# EAGLE design ffboard_adapter (EAGLE 9.6.2)
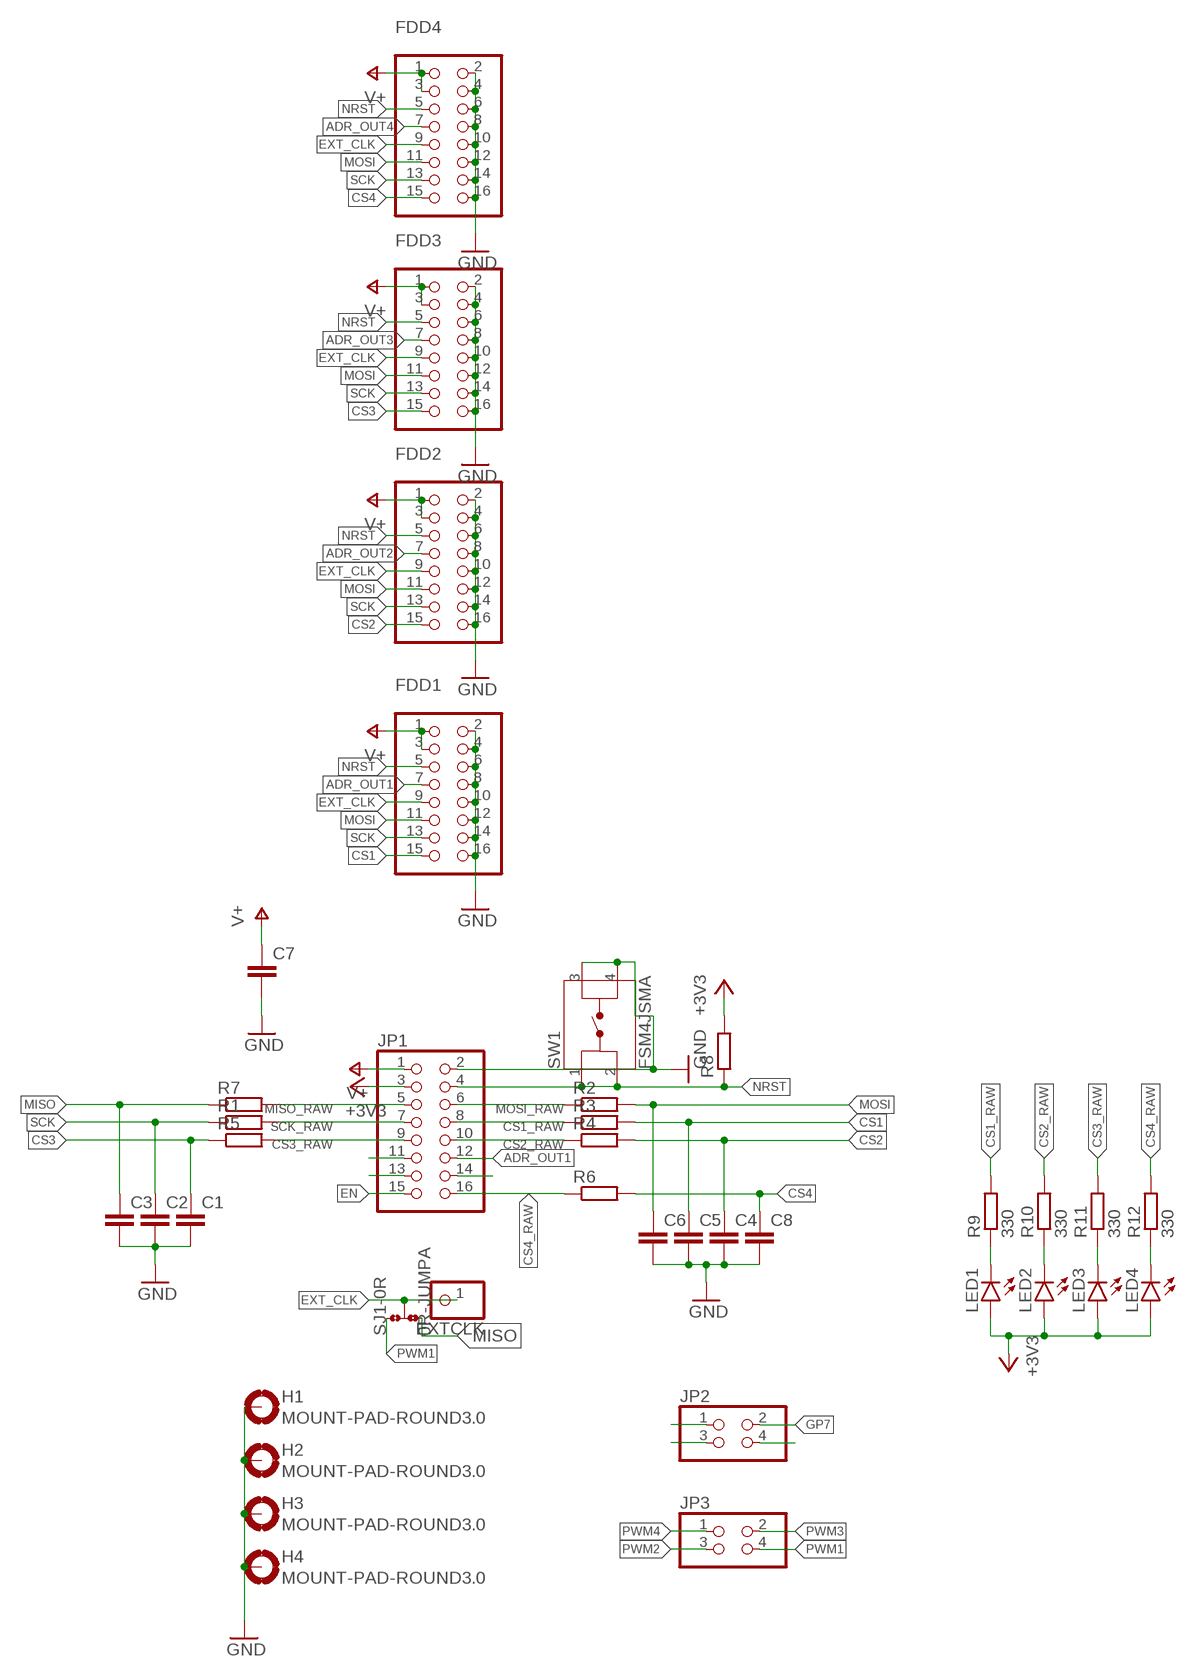
[diagram p0: schematic, sheet 1]

## Parts
C1  C-EUC0603  [C0603]
C2  C-EUC0603  [C0603]
C3  C-EUC0603  [C0603]
C4  C-EUC0603  [C0603]
C5  C-EUC0603  [C0603]
C6  C-EUC0603  [C0603]
C7  C-EUC0603  [C0603]
C8  C-EUC0603  [C0603]
EXTCLK  PINHD-1X1  [1X01]
FDD1  C221085  PINHD-2X8  [2X08]
FDD2  C221085  PINHD-2X8  [2X08]
FDD3  C221085  PINHD-2X8  [2X08]
FDD4  C221085  PINHD-2X8  [2X08]
H1  MOUNT-PAD-ROUND3.0  [3,0-PAD]
H2  MOUNT-PAD-ROUND3.0  [3,0-PAD]
H3  MOUNT-PAD-ROUND3.0  [3,0-PAD]
H4  MOUNT-PAD-ROUND3.0  [3,0-PAD]
JP1  PINHD-2X8  [2X08]
JP2  PINHD-2X2  [2X02]
JP3  PINHD-2X2  [2X02]
LED1  LEDSML0805  [SML0805]
LED2  LEDSML0805  [SML0805]
LED3  LEDSML0805  [SML0805]
LED4  LEDSML0805  [SML0805]
R1  R-EU_R0603  [R0603]
R2  R-EU_R0603  [R0603]
R3  R-EU_R0603  [R0603]
R4  R-EU_R0603  [R0603]
R5  R-EU_R0603  [R0603]
R6  R-EU_R0603  [R0603]
R7  R-EU_R0603  [R0603]
R8  R-EU_R0603  [R0603]
R9  330  R-EU_R0603  [R0603]
R10  330  R-EU_R0603  [R0603]
R11  330  R-EU_R0603  [R0603]
R12  330  R-EU_R0603  [R0603]
SJ1  0R-JUMPA  [A0R-JMP]
SW1  FSM4JSMA  [FSM4JSMA]

## Nets
+3V3: JP1.3 LED1.A LED2.A LED3.A LED4.A R8.2
ADR_OUT1: FDD1.7 JP1.12
ADR_OUT2: FDD2.7
ADR_OUT3: FDD3.7
ADR_OUT4: FDD4.7
CS1: C5.1 FDD1.15 R3.2
CS1_RAW: JP1.8 R3.1 R9.2
CS2: C4.1 FDD2.15 R4.2
CS2_RAW: JP1.10 R4.1 R10.2
CS3: C1.1 FDD3.15 R5.1
CS3_RAW: JP1.9 R5.2 R11.2
CS4: C8.1 FDD4.15 R6.2
CS4_RAW: JP1.16 R6.1 R12.2
EN: JP1.15
EXT_CLK: EXTCLK.1 FDD1.9 FDD2.9 FDD3.9 FDD4.9 SJ1.2
GND: C1.2 C2.2 C3.2 C4.2 C5.2 C6.2 C7.2 C8.2 FDD1.2 FDD1.4 FDD1.6 FDD1.8 FDD1.10 FDD1.12 FDD1.14 FDD1.16 FDD2.2 FDD2.4 FDD2.6 FDD2.8 FDD2.10 FDD2.12 FDD2.14 FDD2.16 FDD3.2 FDD3.4 FDD3.6 FDD3.8 FDD3.10 FDD3.12 FDD3.14 FDD3.16 FDD4.2 FDD4.4 FDD4.6 FDD4.8 FDD4.10 FDD4.12 FDD4.14 FDD4.16 H1.B3,0(MOUNT) H2.B3,0(MOUNT) H3.B3,0(MOUNT) H4.B3,0(MOUNT) JP1.2 SW1.3 SW1.4
GP7: JP2.2
MISO: C3.1 R7.1 SJ1.3
MISO_RAW: JP1.5 R7.2
MOSI: C6.1 FDD1.11 FDD2.11 FDD3.11 FDD4.11 R2.2
MOSI_RAW: JP1.6 R2.1
N$1: LED1.C R9.1
N$2: LED2.C R10.1
N$3: LED3.C R11.1
N$4: LED4.C R12.1
N$6: JP1.11
N$7: JP1.13
N$10: JP1.14
N$12: JP2.4
N$14: JP2.1
N$15: JP2.3
NRST: FDD1.5 FDD2.5 FDD3.5 FDD4.5 JP1.4 R8.1 SW1.1 SW1.2
PWM1: JP3.4 SJ1.1
PWM2: JP3.3
PWM3: JP3.2
PWM4: JP3.1
SCK: C2.1 FDD1.13 FDD2.13 FDD3.13 FDD4.13 R1.1
SCK_RAW: JP1.7 R1.2
V+: C7.1 FDD1.1 FDD1.3 FDD2.1 FDD2.3 FDD3.1 FDD3.3 FDD4.1 FDD4.3 JP1.1

## Library data of the parts
C1-C8 = resistor:C-EU: CAPACITOR, European symbol
EXTCLK = pinhead:PINHD-1X1: PIN HEADER
FDD1-FDD4 JP1 = pinhead:PINHD-2X8: PIN HEADER
H1-H4 = holes:MOUNT-PAD-ROUND: MOUNTING PAD, round
JP2 JP3 = pinhead:PINHD-2X2: PIN HEADER
LED1-LED4 = led:LED: LED OSRAM: - CHIPLED LG R971, LG N971, LY N971, LG Q971, LY Q971, LO R971, LY R971 LH N974, LH R974 LS Q976, LO Q976, LY Q976 LO Q996 - Hyper CHIPLED LW Q18S LB Q993, LB Q99A, LB R99A - SideLED LS A670, LO A670, LY A670, LG A670, LP A670 LB A673, LV A673, LT A673, LW A673 LH A674 LY A675 LS A676, LA A676, LO A676, LY A676, LW A676 LS A679, LY A679, LG A679 - Hyper Micro SIDELED® LS Y876, LA Y876, LO Y876, LY Y876 LT Y87S - SmartLED LW L88C, LW L88S LB L89C, LB L89S, LG L890 LS L89K, LO L89K, LY L89K LS L896, LA L896, LO L896, LY L896 - TOPLED LS T670, LO T670, LY T670, LG T670, LP T670 LSG T670, LSP T670, LSY T670, LOP T670, LYG T670 LG T671, LOG T671, LSG T671 LB T673, LV T673, LT T673, LW T673 LH T674 LS T676, LA T676, LO T676, LY T676, LB T676, LH T676, LSB T676, LW T676 LB T67C, LV T67C, LT T67C, LS T67K, LO T67K, LY T67K, LW E67C LS E67B, LA E67B, LO E67B, LY E67B, LB E67C, LV E67C, LT E67C LW T67C LS T679, LY T679, LG T679 LS T770, LO T770, LY T770, LG T770, LP T770 LB T773, LV T773, LT T773, LW T773 LH T774 LS E675, LA E675, LY E675, LS T675 LS T776, LA T776, LO T776, LY T776, LB T776 LHGB T686 LT T68C, LB T68C - Hyper Mini TOPLED® LB M676 - Mini TOPLED Santana® LG M470 LS M47K, LO M47K, LY M47K Source: http://www.osram.convergy.de LUXEON: - LUMILED® LXK2-PW12-R00, LXK2-PW12-S00, LXK2-PW14-U00, LXK2-PW14-V00 LXK2-PM12-R00, LXK2-PM12-S00, LXK2-PM14-U00 LXK2-PE12-Q00, LXK2-PE12-R00, LXK2-PE12-S00, LXK2-PE14-T00, LXK2-PE14-U00 LXK2-PB12-K00, LXK2-PB12-L00, LXK2-PB12-M00, LXK2-PB14-N00, LXK2-PB14-P00, LXK2-PB14-Q00 LXK2-PR12-L00, LXK2-PR12-M00, LXK2-PR14-Q00, LXK2-PR14-R00 LXK2-PD12-Q00, LXK2-PD12-R00, LXK2-PD12-S00 LXK2-PH12-R00, LXK2-PH12-S00 LXK2-PL12-P00, LXK2-PL12-Q00, LXK2-PL12-R00 Source: www.luxeon.com KINGBRIGHT: KA-3528ASYC Source: www.kingbright.com
R1-R12 = resistor:R-EU_: RESISTOR, European symbol
SJ1 = jump-0r-smd:0R-JUMP: SMD 0R 0805 Jumper
SW1 = Switch:FSM4JSMA: SWITCH TACTILE SPST-NO 0.05A 24V Manufacturer's datasheet <https://www.te.com/commerce/DocumentDelivery/DDEController?Action=srchrtrv&DocNm=2-1437565-7&DocType=Customer+Drawing&DocLang=English>; CREATED_BY: PCBLayout.com; DIGIKEY_PART_NUMBER: 450-1129-ND; MANUFACTURER: TE Connectivity ALCOSWITCH Switches; MPN: FSM4JSMA

## Board
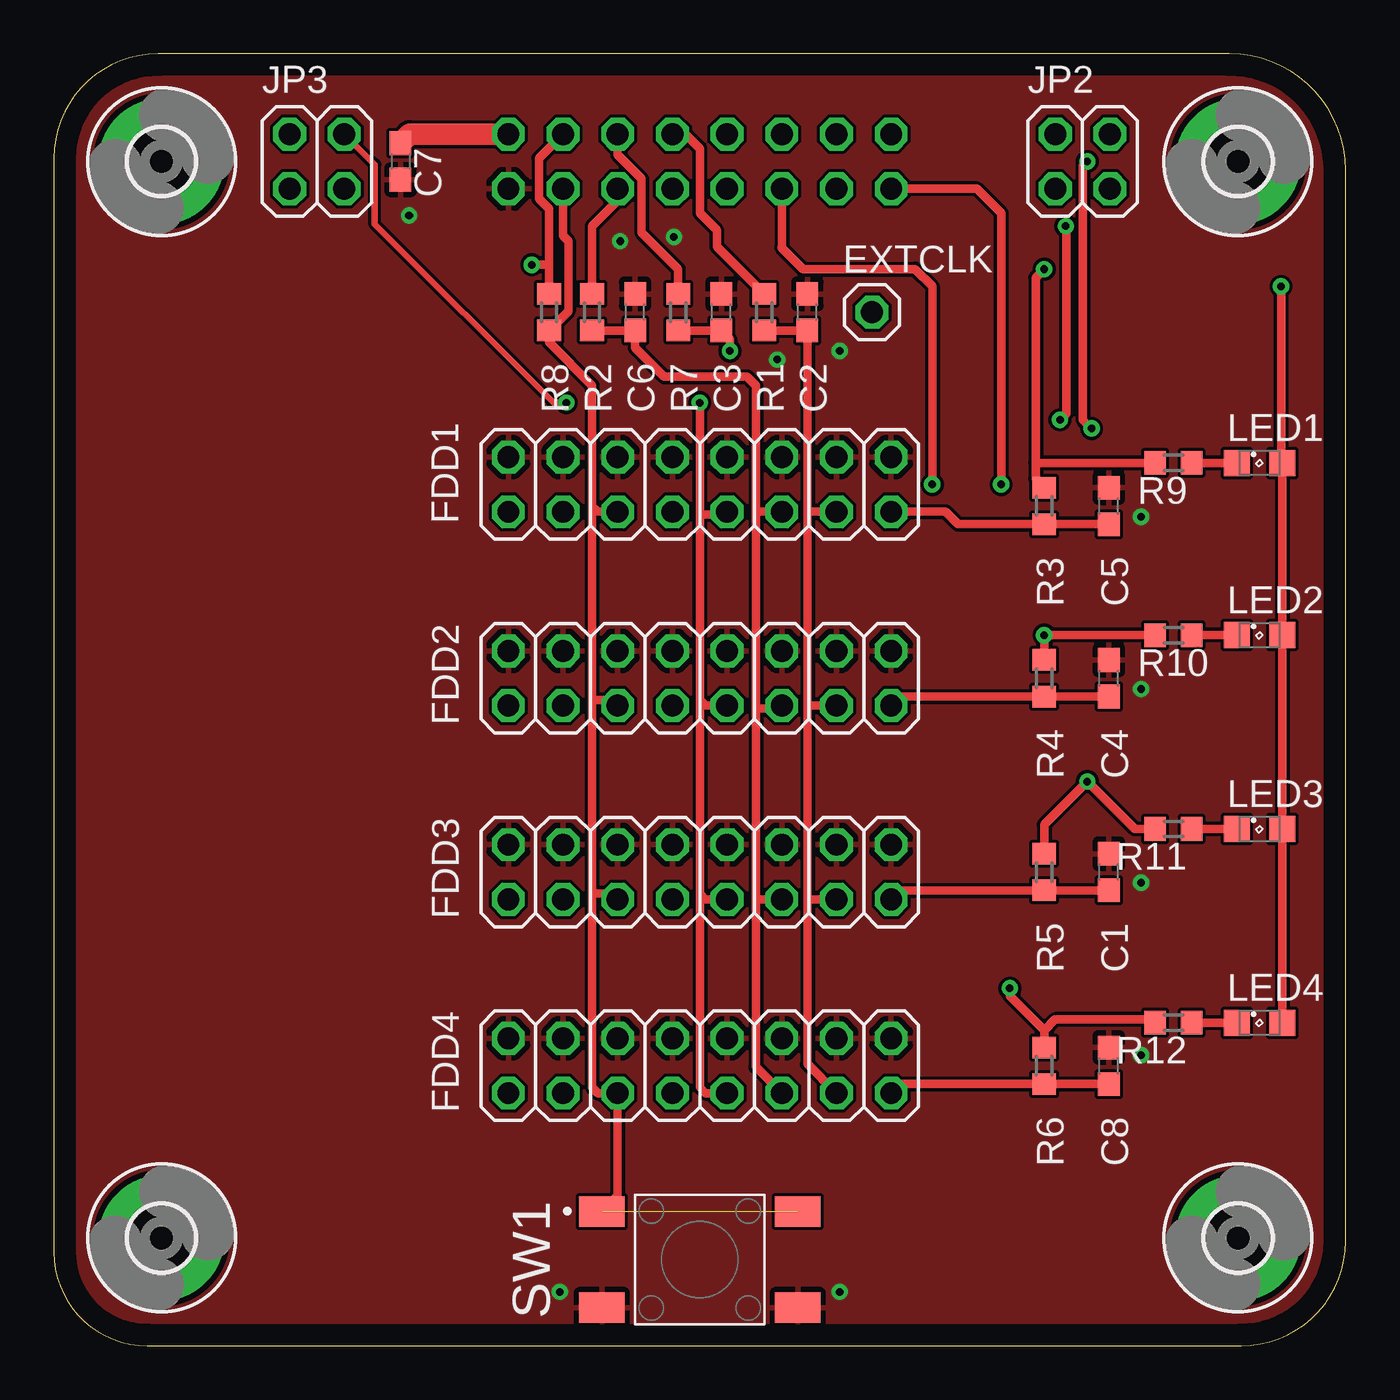
[diagram p1: board, top side]
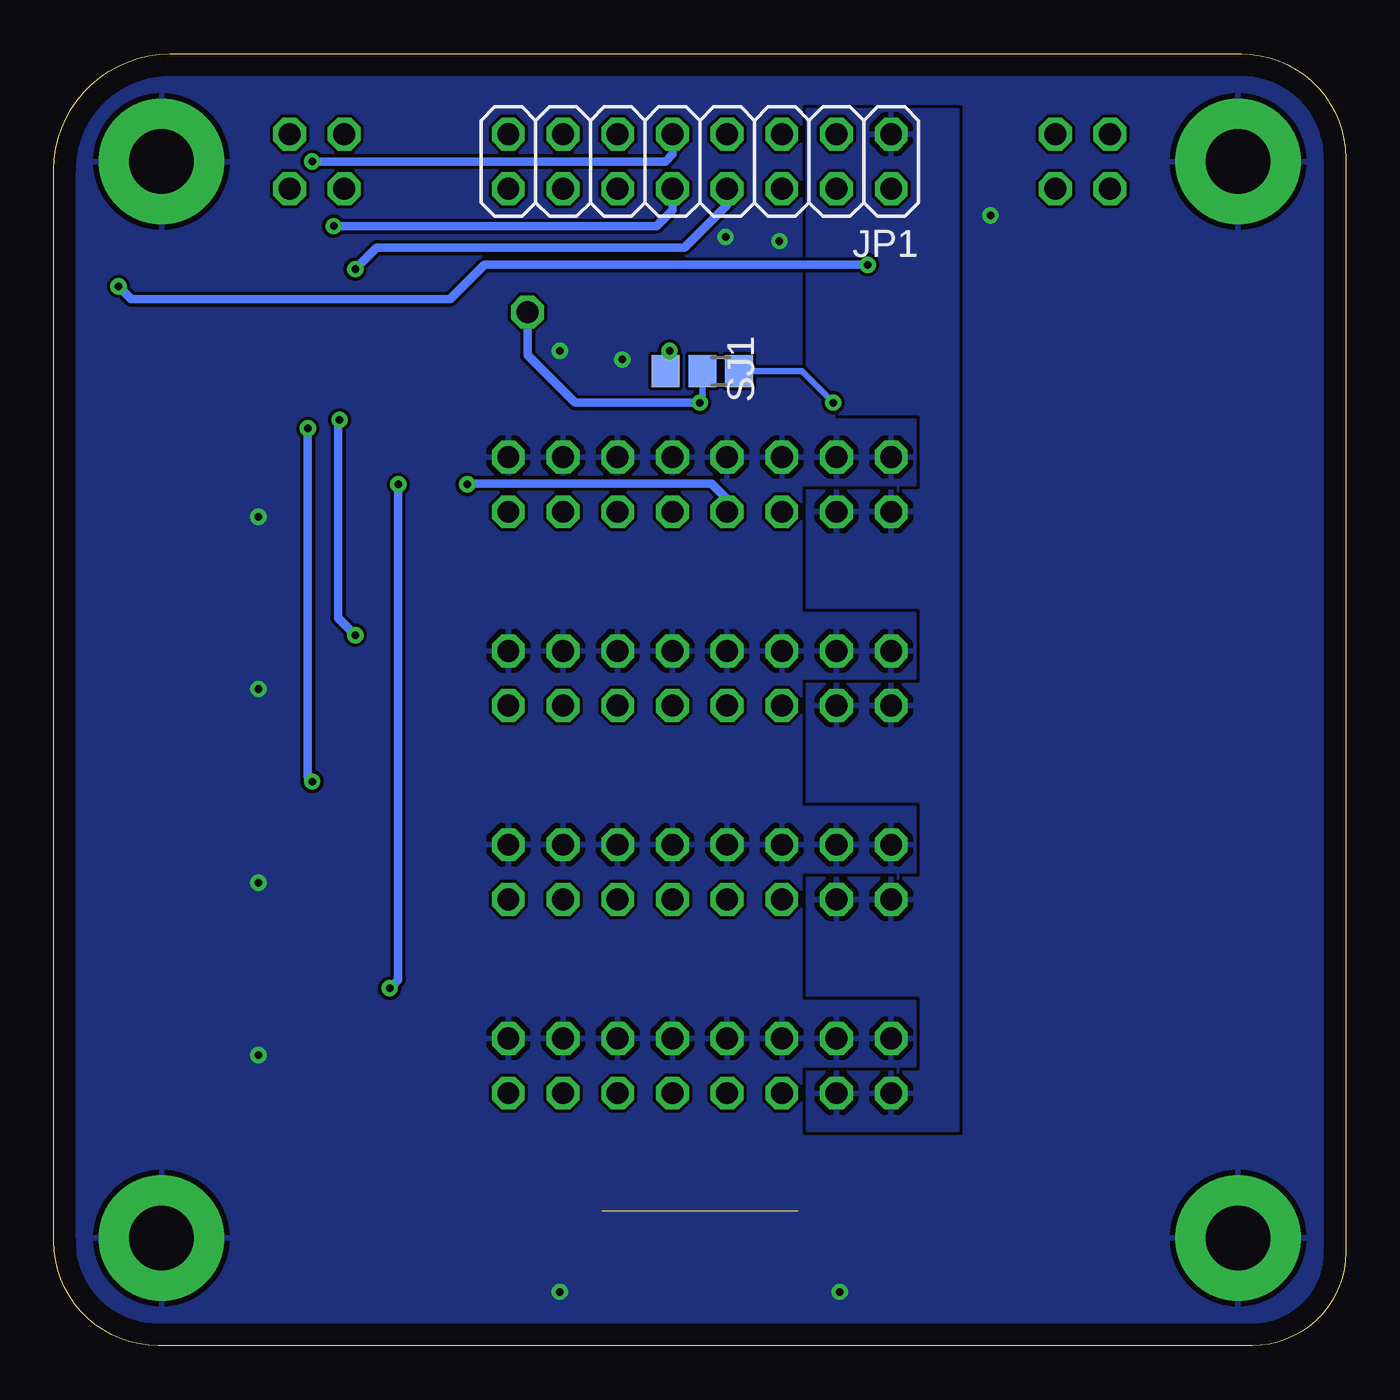
[diagram p2: board, bottom side, seen from below]

Size 60 x 60 mm. Coordinates in mm from the lower left corner, seen from the top.
Outline: 0,55.15 0,4.34 arc90 4.34,0 55.15,0 arc90 60,4.85 60,54.61 arc90 54.61,60 4.85,60 arc90 0,55.15
Copper layers (1*16): Top 0.035mm / dielectric 1.5mm / Bottom 0.035mm
Design rules "default": minimum track width 6mil, minimum drill 0.35mm, track to track 6mil, track to pad 6mil, pad to pad 6mil, via to via 6mil, smd to smd 6mil, copper to edge 40mil, drill to drill 6mil, minimum pad ring 10mil, minimum via ring 8mil, stop-mask expansion 4mil, vias tented up to drill 0mil, thermal gap 10mil

### Footprints (pad centres in the part's own frame; a part is rotated, then mirrored left to right if it is on the bottom)
C0603 = smd 1.1 x 1: 1 -0.85,0; 2 0.85,0
1X01 = drill 1.016 octagon: 1 0,0
2X08 = drill 1.016 octagon: 1 -8.89,-1.27; 2 -8.89,1.27; 3 -6.35,-1.27; 4 -6.35,1.27; 5 -3.81,-1.27; 6 -3.81,1.27; 7 -1.27,-1.27; 8 -1.27,1.27; 9 1.27,-1.27; 10 1.27,1.27; 11 3.81,-1.27; 12 3.81,1.27; 13 6.35,-1.27; 14 6.35,1.27; 15 8.89,-1.27; 16 8.89,1.27
3,0-PAD = drill 3 pad 5.842: B3,0 0,0
2X02 = drill 1.016 octagon: 1 -1.27,-1.27; 2 -1.27,1.27; 3 1.27,-1.27; 4 1.27,1.27
SML0805 = smd 1.2 x 1.2: A 1.05,0; C -1.05,0
R0603 = smd 1 x 1.1: 1 -0.85,0; 2 0.85,0
A0R-JMP = smd 1.5 x 1.3: 1 0,1.7; 2 0,0; 3 0,-1.7
FSM4JSMA = smd 1.4 x 2.1: 1 2.23,4.55; 2 2.23,-4.55; 3 -2.23,4.55; 4 -2.23,-4.55

### Placement (x,y rotation side)
C1  49,22 90 top
C2  35,48 90 top
C3  31,48 90 top
C4  49,31 90 top
C5  49,39 90 top
C6  27,48 90 top
C7  16.1,55 270 top
C8  49,13 90 top
EXTCLK  38,48 0 top
FDD1  30,40 0 top
FDD2  30,31 0 top
FDD3  30,22 0 top
FDD4  30,13 0 top
H1  55,55 0 top
H2  55,5 0 top
H3  5,55 0 top
H4  5,5 0 top
JP1  30,55 180 bottom
JP2  47.78,55 0 top
JP3  12.22,55 0 top
LED1  56,41 0 top
LED2  56,33 0 top
LED3  56,24 0 top
LED4  56,15 0 top
R1  33,48 90 top
R2  25,48 270 top
R3  46,39 270 top
R4  46,31 270 top
R5  46,22 90 top
R6  46,13 270 top
R7  29,48 90 top
R8  23,48 90 top
R9  52,41 180 top
R10  52,33 180 top
R11  52,24 180 top
R12  52,15 180 top
SJ1  29.88,45.26 270 bottom
SW1  30,4 90 top

### Tracks (layer width: path | path; a pad name or v marks a point on that pad's centre or on a via)
+3V3  (via drill 0.35)
  Top 0.4: 23,50.2 23,52.8 22.54,53.27 22.54,55.16 JP1.3 | 23,50.2 R8.2 | LED4.A LED3.A LED2.A LED1.A 57,41.05 v57,49.2 | v22.2,50.2 23,50.2
  Bottom 0.4: v57,49.2 56.4,48.6 41.6,48.6 40,50.2 v22.2,50.2
ADR_OUT1  (via drill 0.35)
  Top 0.4: JP1.12 33.81,51.01 33.8,51 34.8,50 40,50 40.8,49.2 v40.8,40
  Bottom 0.4: v40.8,40 40.76,40.04 29.44,40.04 28.73,39.33 FDD1.7
CS1
  Top 0.4: FDD1.15 41.42,38.73 42,38.15 R3.2 C5.1
CS1_RAW  (via drill 0.35)
  Top 0.4: 45.6,41 45.6,49.6 v46,50 | 45.6,41 45.6,40.25 R3.1 | R9.2 45.6,41
  Bottom 0.4: v46,50 45,51 30.7,51 28.73,52.97 JP1.8
CS2
  Top 0.4: FDD2.15 39.31,30.15 R4.2 C4.1
CS2_RAW  (via drill 0.35)
  Top 0.4: R4.1 v46,33 R10.2 | v47,52 47.03,51.97 47.03,43.3 v46.73,43
  Bottom 0.4: v46.73,43 46.8,42.93 46.8,33.8 v46,33 | v47,52 32,52 31.27,52.73 JP1.10
CS3
  Top 0.4: FDD3.15 39.31,21.15 R5.1 C1.1
CS3_RAW  (via drill 0.35)
  Top 0.4: v48,55 47.8,54.8 47.8,43 v48.2,42.6 | R5.2 46,24.2 v48,26.2 50.2,24 R11.2
  Bottom 0.4: JP1.9 31.27,55.33 31.6,55 v48,55 | v48.2,42.6 48.2,26.4 v48,26.2
CS4
  Top 0.4: FDD4.15 39.31,12.15 R6.2 C8.1
CS4_RAW  (via drill 0.35)
  Top 0.4: 46,14.65 46.5,15.15 51,15.15 R12.2 | R6.1 46,14.65 | v44.4,16.6 44.4,16.25 46,14.65 | v44,40 44,52.6 42.87,53.73 JP1.16
  Bottom 0.4: v44.4,16.6 44,17 v44,40
EXT_CLK  (via drill 0.35)
  Top 0.4: FDD1.9 31.14,38.6 30,38.6 | 30,30 30,38.6 | 30,30 30,21 | 30,21 30,12 30.27,11.73 FDD4.9 | FDD3.9 30.27,20.73 30,21 | FDD2.9 30.27,29.73 30,30 | 30,38.6 v30,43.8
  Bottom 0.3: v30,43.8 29.88,43.92 SJ1.2
  Bottom 0.4: EXTCLK.1 38,46 35.8,43.8 v30,43.8
GND  (via drill 0.35)
  other vias: 16.5,52.5 23.5,2.5 36.5,2.5 50.5,13.5 50.5,21.5 50.5,30.5 50.5,38.5 36.5,46.2 33.6,45.8 26.3,51.3 28.8,51.5
  pour Top (rank 6): -1,61 61,61 61,-1 -1,-1
  pour Bottom (rank 6): -1,62 61,62 61,0 -1,0
  pour Bottom: 20,43 40,43 40,40 20,40
  pour Bottom: 20,16 40,16 40,13 20,13
  pour Bottom: 20,25 40,25 40,22 20,22
  pour Bottom: 20,34 40,34 40,31 20,31
MISO  (via drill 0.35)
  Top 0.4: R7.1 C3.1 31.4,46.75 v31.4,46.2
  Bottom 0.4: v31.4,46.2 31.58,46.02 SJ1.3
MISO_RAW
  Top 0.4: JP1.5 26.19,55.31 27.3,54.19 27.3,51.7 29,50 R7.2
MOSI
  Top 0.4: R2.2 26.85,47.15 27,47 C6.1 27,46.35 28.35,45 32.2,45 32.6,44.6 32.6,38.6 | FDD4.11 32.6,12.94 32.6,20.8 | 32.6,38.6 32.6,29.6 | 32.6,29.6 32.6,20.8 | FDD3.11 32.67,20.73 32.6,20.8 | FDD2.11 33.68,29.6 32.6,29.6 | FDD1.11 32.73,38.73 32.6,38.6
MOSI_RAW
  Top 0.4: JP1.6 26.19,53.19 25,52 R2.1
N$1
  Top 0.4: LED1.C R9.1
N$2
  Top 0.4: LED2.C R10.1
N$3
  Top 0.4: LED3.C R11.1
N$4
  Top 0.4: LED4.C R12.1
NRST  (1 unrouted)
  Top 0.4: 25,39 25,44.6 23,46.6 R8.1 23.9,48.05 23.9,51.3 23.65,51.55 JP1.4 | 25,39 25.27,38.73 FDD1.5 | 25,39 25,30 | 25,30 25,21 | 25,21 25,12 25.27,11.73 FDD4.5 26.19,6.97 SW1.1 | FDD3.5 25.92,21 25,21 | FDD2.5 25.92,30 25,30
PWM1  (via drill 0.35)
  Top 0.3: JP3.4 14.9,54.86 14.9,52.1 23.2,43.8 v23.8,43.8
  Bottom 0.3: v23.8,43.8 25.26,45.26 SJ1.1
SCK
  Top 0.4: R1.1 C2.1 35,38.6 | 35,38.6 35,29.6 | 35,29.6 35,20.6 | 35,20.6 35,13.08 FDD4.13 | FDD3.13 35.13,20.73 35,20.6 | FDD2.13 35.13,29.73 35,29.6 | FDD1.13 35.13,38.73 35,38.6
SCK_RAW
  Top 0.4: R1.2 30.8,51.05 30.8,51.8 30,52.6 30,55.6 29.33,56.27 JP1.7
V+
  Top 1: C7.1 16.52,56.27 JP1.1
  pour Bottom (rank 3): 25,57.4 18,57.4 18,10 25,10